# EAGLE design LPC_4TE_4.03bot (EAGLE 5.04)
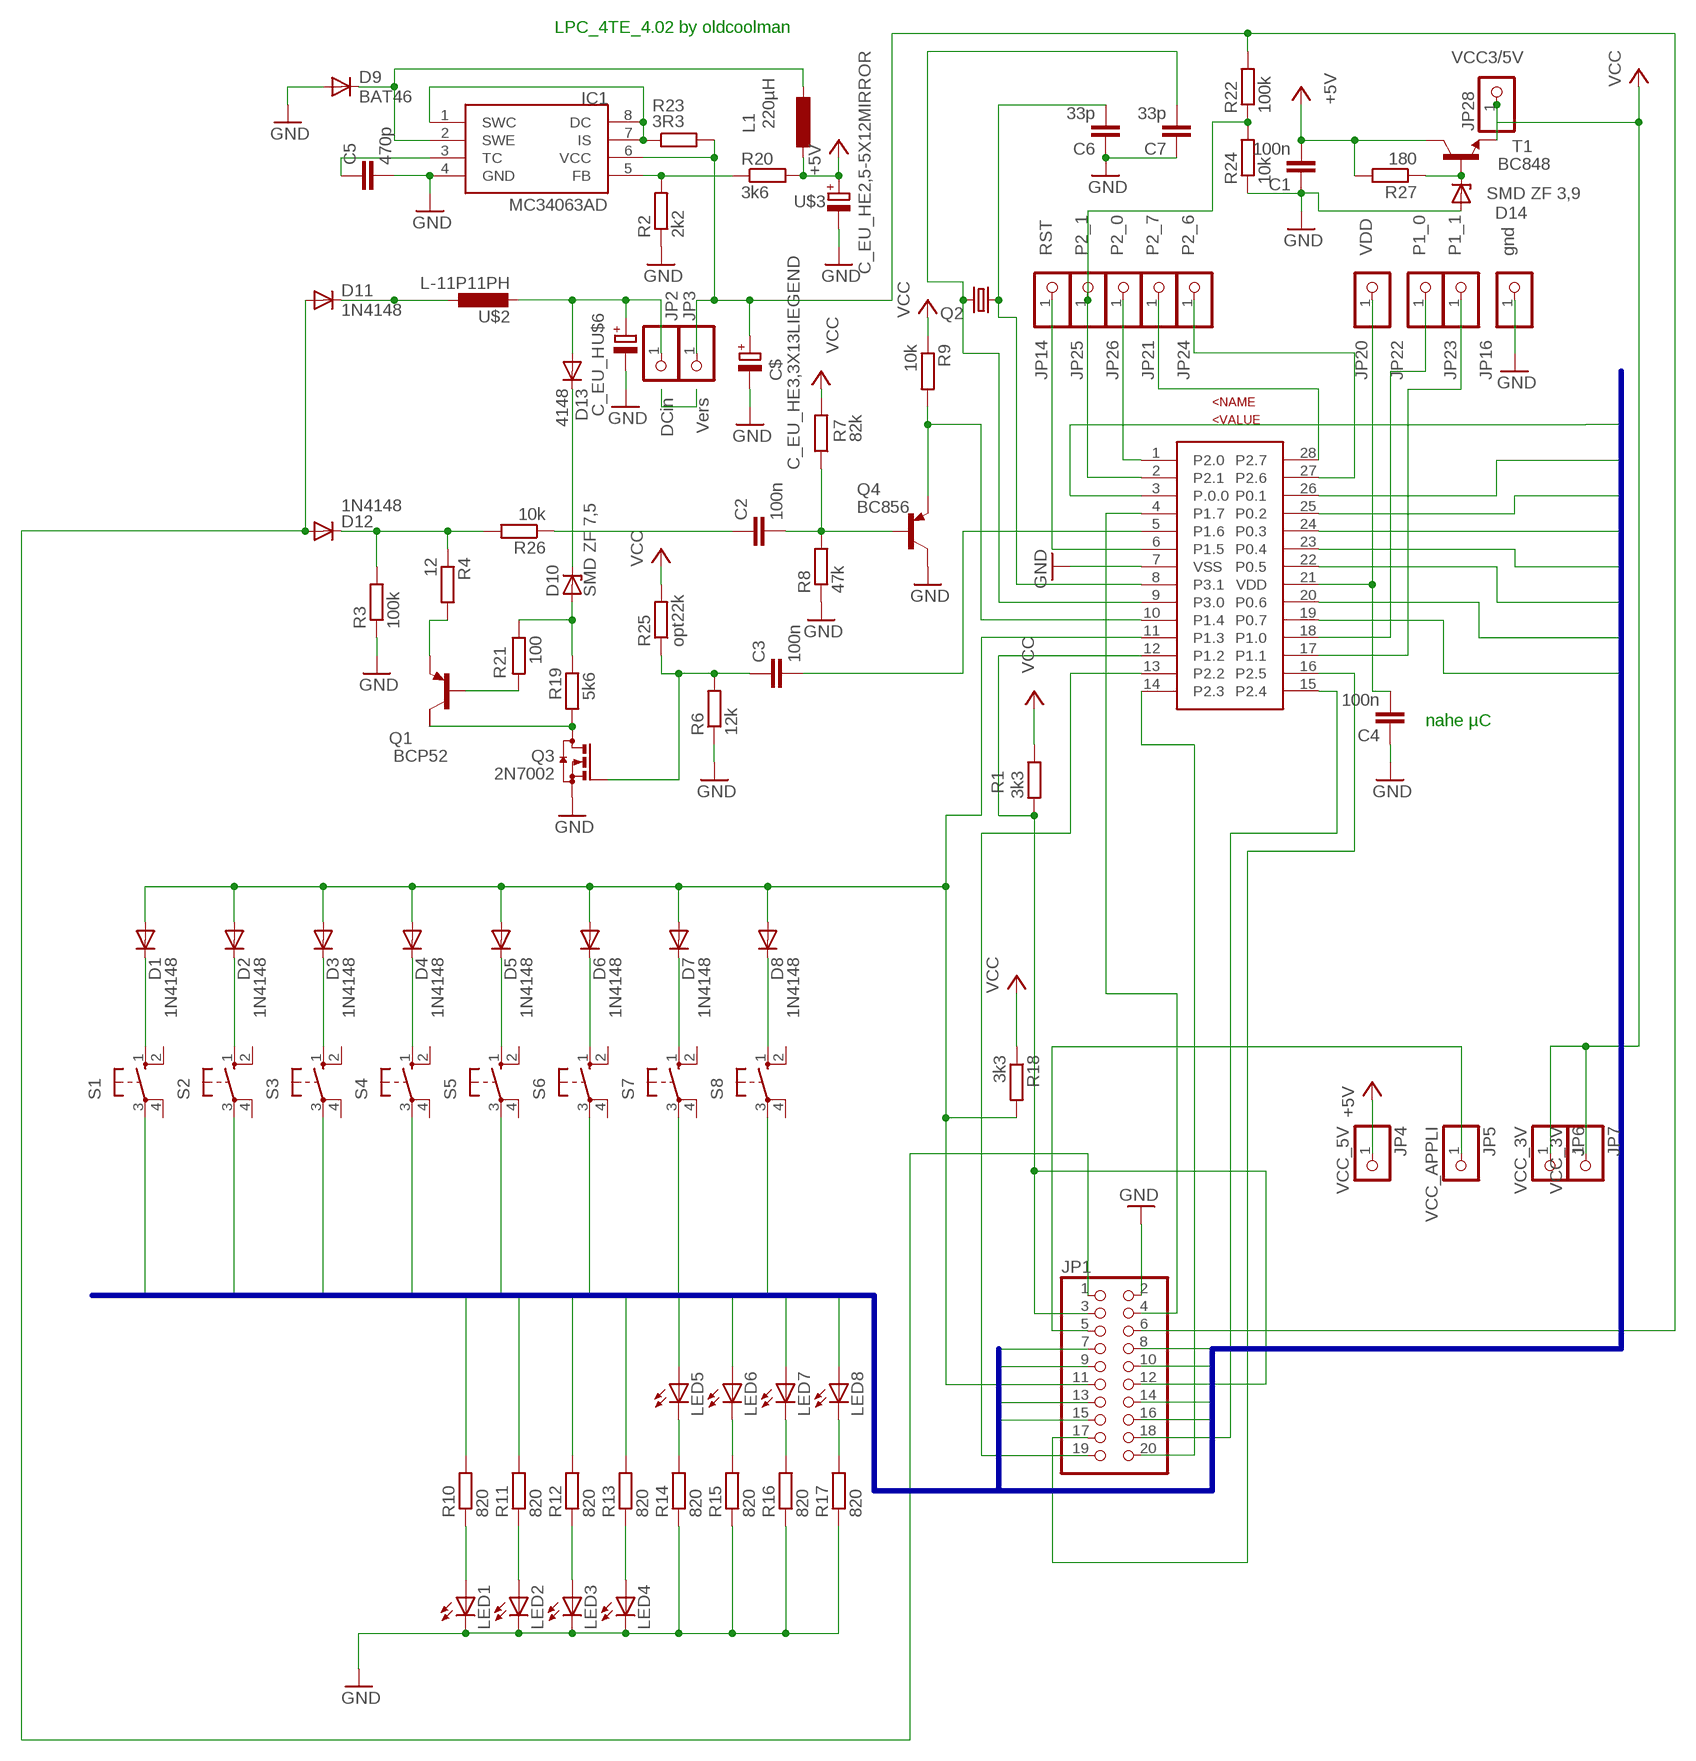
[diagram p0: schematic, sheet 1]

## Parts
C1  100n  C-EUC1206  [C1206]
C2  100n  C-EUC1206  [C1206]
C3  100n  C-EUC1206  [C1206]
C4  100n  C-EUC1206  [C1206]
C5  470p  C-EUC1206  [C1206]
C6  33p  C-EUC1206  [C1206]
C7  33p  C-EUC1206  [C1206]
C$  C_EU_HE3,3X13LIEGEND  [E3,3-7,5X13]
D1  1N4148  DIODE-MINIMELF  [MINIMELF]
D2  1N4148  DIODE-MINIMELF  [MINIMELF]
D3  1N4148  DIODE-MINIMELF  [MINIMELF]
D4  1N4148  DIODE-MINIMELF  [MINIMELF]
D5  1N4148  DIODE-MINIMELF  [MINIMELF]
D6  1N4148  DIODE-MINIMELF  [MINIMELF]
D7  1N4148  DIODE-MINIMELF  [MINIMELF]
D8  1N4148  DIODE-MINIMELF  [MINIMELF]
D9  BAT46  DIODE-MINIMELF  [MINIMELF]
D10  SMD ZF 7,5  ZPD  [MINIMELF]
D11  1N4148  DIODE-MINIMELF  [MINIMELF]
D12  1N4148  DIODE-MINIMELF  [MINIMELF]
D13  4148  DIODE-MINIMELF  [MINIMELF]
D14  SMD ZF 3,9  ZPD  [MINIMELF]
IC1  MC34063AD  [SOIC8]
JP1  PINHD-2X10  [2X10]
JP2  DCin  PINHD-1X1  [1X01]
JP3  Vers  PINHD-1X1  [1X01]
JP4  VCC_5V  PINHD-1X1  [1X01]
JP5  VCC_APPLI  PINHD-1X1  [1X01]
JP6  VCC_3V  PINHD-1X1  [1X01]
JP7  VCC_3V  PINHD-1X1  [1X01]
JP14  RST  PINHD-1X1  [1X01]
JP16  gnd  PINHD-1X1  [1X01]
JP20  VDD  PINHD-1X1  [1X01]
JP21  P2_7  PINHD-1X1  [1X01]
JP22  P1_0  PINHD-1X1  [1X01]
JP23  P1_1  PINHD-1X1  [1X01]
JP24  P2_6  PINHD-1X1  [1X01]
JP25  P2_1  PINHD-1X1  [1X01]
JP26  P2_0  PINHD-1X1  [1X01]
JP28  VCC3/5V  PINHD-1X1  [1X01]
L1  220µH  L-EU2200-11.43  [2200-11.43]
LED1  LED3MM  [LED3MM]
LED2  LED3MM  [LED3MM]
LED3  LED3MM  [LED3MM]
LED4  LED3MM  [LED3MM]
LED5  LED3MM  [LED3MM]
LED6  LED3MM  [LED3MM]
LED7  LED3MM  [LED3MM]
LED8  LED3MM  [LED3MM]
Q1  BCP52  FZT753SMD  [SOT223]
Q2  CRYSTALHC49U-V  [HC49U-V]
Q3  2N7002  BSS123  [SOT23]
Q4  BC856  BC856ALT1SMD  [SOT23-BEC]
R1  3k3  R-EU_M1206  [M1206]
R2  2k2  R-EU_R1206  [R1206]
R3  100k  R-EU_M1206  [M1206]
R4  12  R-EU_R1206  [R1206]
R6  12k  R-EU_R1206  [R1206]
R7  82k  R-EU_R1206  [R1206]
R8  47k  R-EU_M1206  [M1206]
R9  10k  R-EU_R1206  [R1206]
R10  820  R-EU_R1206  [R1206]
R11  820  R-EU_R1206  [R1206]
R12  820  R-EU_R1206  [R1206]
R13  820  R-EU_R1206  [R1206]
R14  820  R-EU_R1206  [R1206]
R15  820  R-EU_R1206  [R1206]
R16  820  R-EU_R1206  [R1206]
R17  820  R-EU_R1206  [R1206]
R18  3k3  R-EU_R1206  [R1206]
R19  5k6  R-EU_M1206  [M1206]
R20  3k6  R-EU_M1206  [M1206]
R21  100  R-EU_R1206  [R1206]
R22  100k  R-EU_R1206  [R1206]
R23  3R3  R-EU_M1206  [M1206]
R24  10k  R-EU_R1206  [R1206]
R25  opt22k  R-EU_R1206  [R1206]
R26  10k  R-EU_R1206  [R1206]
R27  180  R-EU_R1206  [R1206]
S1  10-XX  [B3F-10XX]
S2  10-XX  [B3F-10XX]
S3  10-XX  [B3F-10XX]
S4  10-XX  [B3F-10XX]
S5  10-XX  [B3F-10XX]
S6  10-XX  [B3F-10XX]
S7  10-XX  [B3F-10XX]
S8  10-XX  [B3F-10XX]
T1  BC848  [SOT23]
U$1  LPC936TSSOP28  [TSSOP28]
U$2  L-11P11PH  [11PH]
U$3  C_EU_HE2,5-5X12MIRROR  [E2,5-5X12MIRR]
U$6  C_EU_H  [E2,5-5X12]

## Nets
+5V: C1.2 JP4.1 L1.1 R20.2 R27.2 T1.3(C) U$3.+
GND: C1.1 C4.1 C5.2 C6.1 C7.1 C$.- D9.A D14.A IC1.4(GND) JP1.2 JP16.1 LED1.K(C) LED2.K(C) LED3.K(C) LED4.K(C) Q3.2(S) Q4.C R2.1 R3.1 R6.1 R8.1 R14.1 R15.1 R16.1 R17.1 R24.1 U$1.7(VSS) U$3.- U$6.-
N$1: D1.C S1.1(S)
N$2: D2.C S2.1(S)
N$3: D3.C S3.1(S)
N$4: D4.C S4.1(S)
N$5: D14.C R27.1 T1.1(B)
N$6: D5.C S5.1(S)
N$7: D6.C S6.1(S)
N$8: D7.C S7.1(S)
N$10: D8.C S8.1(S)
N$11: D13.A JP2.1 U$2.P$2 U$6.+
N$12: C$.+ IC1.6(VCC) JP1.6 JP3.1 R22.2 R23.2
N$13: JP1.5 JP5.1
N$14: LED5.K(C) R14.2
N$15: LED1.A R10.1
N$16: LED6.K(C) R15.2
N$17: LED7.K(C) R16.2
N$18: LED8.K(C) R17.2
N$19: Q4.E R9.2 U$1.10(P1.4)
N$20: LED2.A R11.1
N$21: LED3.A R12.1
N$22: LED4.A R13.1
N$23: C2.2 Q4.B R7.1 R8.2
N$24: C3.2 U$1.5(P1.6)
N$25: D12.C R3.2 R4.1 R26.2
N$26: IC1.5(FB) R2.2 R20.1
N$27: D9.C IC1.2(SWE) L1.2
N$28: C5.1 IC1.3(TC)
N$29: JP22.1 U$1.18(P1.0)
N$30: JP23.1 U$1.17(P1.1)
N$31: JP14.1 U$1.6(P1.5)
N$32: C4.2 JP20.1 U$1.21(VDD)
N$33: D1.A D2.A D3.A D4.A D5.A D6.A D7.A D8.A JP1.11 R18.2 U$1.11(P1.3)
N$34: C3.1 Q3.1(G) R6.2 R25.1
N$35: JP25.1 R22.1 R24.2 U$1.2(P2.1)
N$36: D11.C U$2.P$1
N$37: Q1.2(C) Q3.3(D) R19.1
N$38: D10.A R19.2 R21.1
N$39: Q1.3(E) R4.2
N$40: Q1.1(B) R21.2
N$41: D10.C D13.C
N$42: JP1.18 U$1.15(P2.4)
N$43: JP1.4 U$1.4(P1.7)
N$44: D11.A D12.A JP1.1
N$45: C6.2 Q2.1 U$1.8(P3.1)
N$46: C7.2 Q2.2 U$1.9(P3.0)
N$47: JP1.19 U$1.13(P2.2)
N$48: JP1.17 U$1.16(P2.5)
N$49: JP1.20 U$1.14(P2.3)
N$50: JP1.3 JP1.12 R1.2 U$1.12(P1.2)
N$51: C2.1 R26.1
N$56: JP21.1 U$1.28(P2.7)
N$57: JP24.1 U$1.27(P2.6)
N$58: JP26.1 U$1.1(P2.0)
N$61: IC1.1(SWC) IC1.7(IS) IC1.8(DC) R23.1
P0.0: JP1.7 R10.2 S1.3(P) U$1.3(P.0.0)
P0.1: JP1.8 R11.2 S2.3(P) U$1.26(P0.1)
P0.2: JP1.9 R12.2 S3.3(P) U$1.25(P0.2)
P0.3: JP1.10 R13.2 S4.3(P) U$1.24(P0.3)
P0.4: JP1.13 LED5.A S5.3(P) U$1.23(P0.4)
P0.5: JP1.14 LED6.A S6.3(P) U$1.22(P0.5)
P0.6: JP1.15 LED7.A S7.3(P) U$1.20(P0.6)
P0.7: JP1.16 LED8.A S8.3(P) U$1.19(P0.7)
VCC: JP6.1 JP7.1 JP28.1 R1.1 R7.2 R9.1 R18.1 R25.2 T1.2(E)
Unconnected: Q1.4(C/) S1.2(S1) S1.4(P1) S2.2(S1) S2.4(P1) S3.2(S1) S3.4(P1) S4.2(S1) S4.4(P1) S5.2(S1) S5.4(P1) S6.2(S1) S6.4(P1) S7.2(S1) S7.4(P1) S8.2(S1) S8.4(P1)

## Buses
P0.[0..7]

## Notes on the sheet
- LPC_4TE_4.02 by oldcoolman
- nahe µC

## Library data of the parts
C1-C7 = rcl:C-EU: CAPACITOR, European symbol
C$ U$3 U$6 = rcl:C_EU_H
D1-D9 D11-D13 = diode:DIODE-: DIODE
D10 D14 = diode:ZPD: Z DIODE 500 mW
IC1 = mc34063:MC34063
JP1 = pinhead:PINHD-2X10: PIN HEADER
JP2-JP7 JP14 JP16 JP20-JP26 JP28 = pinhead:PINHD-1X1: PIN HEADER
L1 = rcl:L-EU: INDUCTOR, European symbol
LED1-LED8 = led:LED: LED OSRAM: - CHIPLED LG R971, LG N971, LY N971, LG Q971, LY Q971, LO R971, LY R971 LH N974, LH R974 LS Q976, LO Q976, LY Q976 LO Q996 - Hyper CHIPLED LW Q18S LB Q993, LB Q99A, LB R99A - SideLED LS A670, LO A670, LY A670, LG A670, LP A670 LB A673, LV A673, LT A673, LW A673 LH A674 LY A675 LS A676, LA A676, LO A676, LY A676, LW A676 LS A679, LY A679, LG A679 - Hyper Micro SIDELED® LS Y876, LA Y876, LO Y876, LY Y876 LT Y87S - SmartLED LW L88C, LW L88S LB L89C, LB L89S, LG L890 LS L89K, LO L89K, LY L89K LS L896, LA L896, LO L896, LY L896 - TOPLED LS T670, LO T670, LY T670, LG T670, LP T670 LSG T670, LSP T670, LSY T670, LOP T670, LYG T670 LG T671, LOG T671, LSG T671 LB T673, LV T673, LT T673, LW T673 LH T674 LS T676, LA T676, LO T676, LY T676, LB T676, LH T676, LSB T676, LW T676 LB T67C, LV T67C, LT T67C, LS T67K, LO T67K, LY T67K, LW E67C LS E67B, LA E67B, LO E67B, LY E67B, LB E67C, LV E67C, LT E67C LW T67C LS T679, LY T679, LG T679 LS T770, LO T770, LY T770, LG T770, LP T770 LB T773, LV T773, LT T773, LW T773 LH T774 LS E675, LA E675, LY E675, LS T675 LS T776, LA T776, LO T776, LY T776, LB T776 LHGB T686 LT T68C, LB T68C - Hyper Mini TOPLED® LB M676 - Mini TOPLED Santana® LG M470 LS M47K, LO M47K, LY M47K Source: http://www.osram.convergy.de - LUMILED® LXK2-PW12-R00, LXK2-PW12-S00, LXK2-PW14-U00, LXK2-PW14-V00 LXK2-PM12-R00, LXK2-PM12-S00, LXK2-PM14-U00 LXK2-PE12-Q00, LXK2-PE12-R00, LXK2-PE12-S00, LXK2-PE14-T00, LXK2-PE14-U00 LXK2-PB12-K00, LXK2-PB12-L00, LXK2-PB12-M00, LXK2-PB14-N00, LXK2-PB14-P00, LXK2-PB14-Q00 LXK2-PR12-L00, LXK2-PR12-M00, LXK2-PR14-Q00, LXK2-PR14-R00 LXK2-PD12-Q00, LXK2-PD12-R00, LXK2-PD12-S00 LXK2-PH12-R00, LXK2-PH12-S00 LXK2-PL12-P00, LXK2-PL12-Q00, LXK2-PL12-R00 Source: www.luxeon.com
Q1 = transistor-pnp:FZT753SMD: PNP Transistor
Q2 = crystal:CRYSTAL: CRYSTAL
Q3 = transistor-small-signal:BSS123: N-CHANNEL MOS FET
Q4 = transistor-pnp:BC856*: PNP Transistror
R1-R4 R6-R27 = rcl:R-EU_: RESISTOR, European symbol
S1-S8 = switch-omron:10-XX: OMRON SWITCH
T1 = transistor:BC848: NPN TRANSISTOR
U$1 = freebuslpc:LPC936: C51 Based Microcontroller LPC936 ADC and 16kbyte Flash
U$2 = rcl:L-11P

## Board
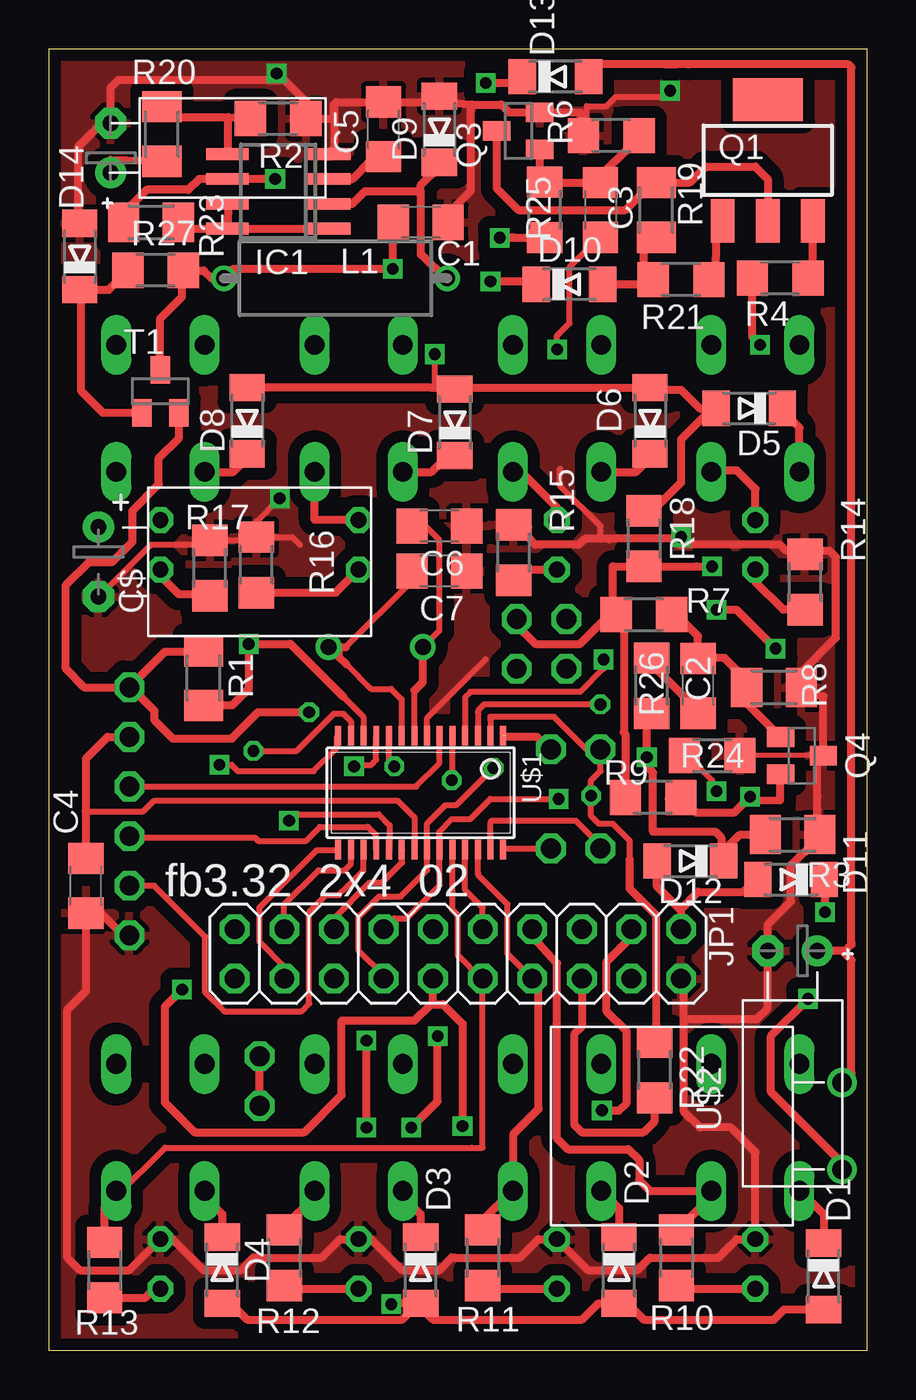
[diagram p1: board, top side]
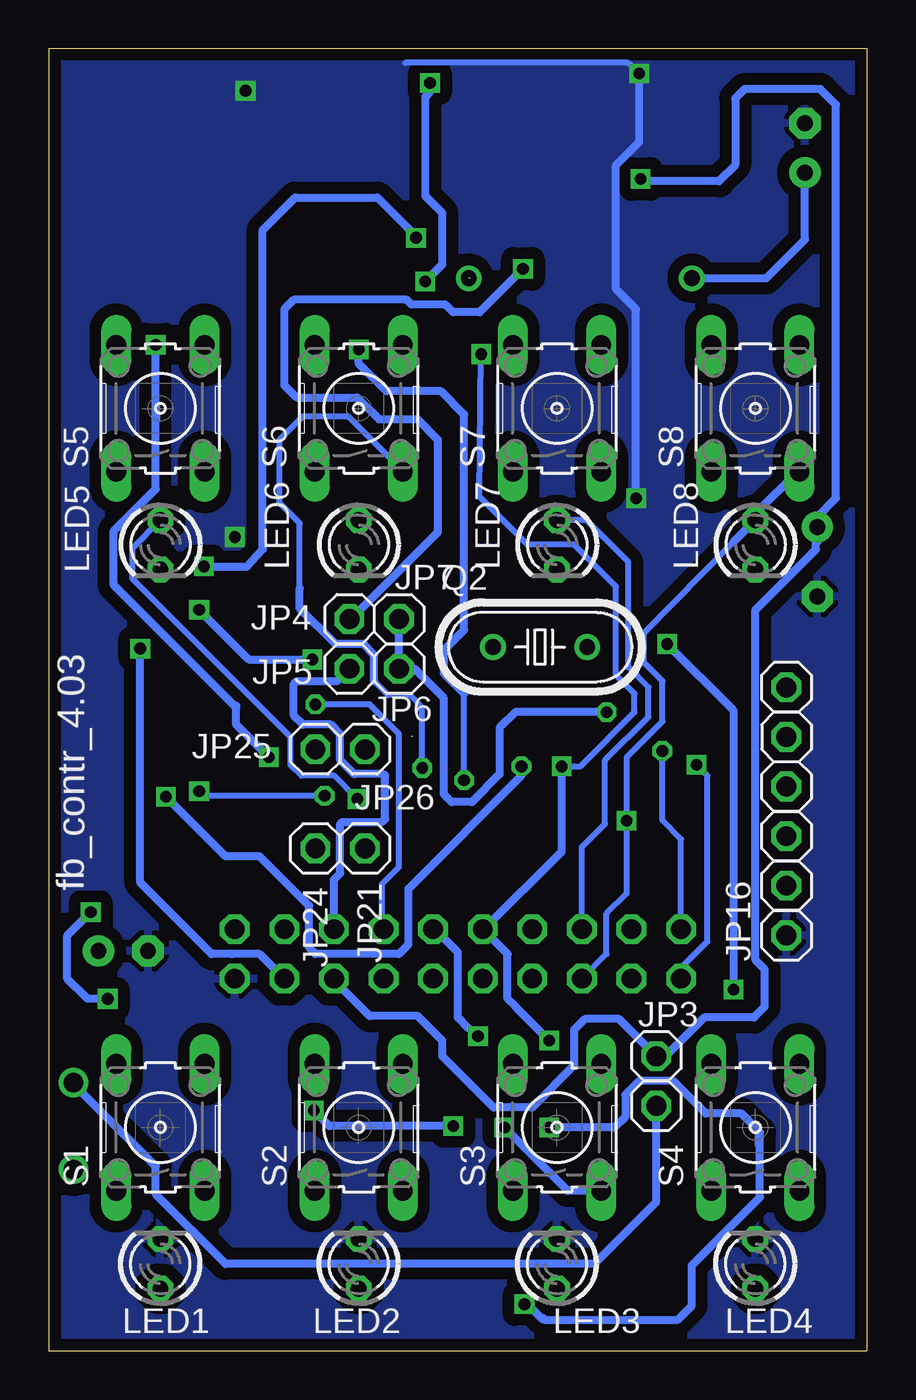
[diagram p2: board, bottom side, seen from below]

Size 41.91 x 66.67 mm. Coordinates in mm from the lower left corner, seen from the top.
Outline: 0,66.68 41.91,66.68 41.91,0 0,0 0,66.68
Copper layers (1*16): Top 0.035mm / dielectric 1.5mm / Bottom 0.035mm
Design rules "default *": minimum track width 10mil, minimum drill 24mil, track to track 12mil, track to pad 12mil, pad to pad 12mil, via to via 12mil, smd to smd 8mil, copper to edge 0.5mm, drill to drill 8mil, minimum pad ring 10mil, minimum via ring 8mil, stop-mask expansion 4mil, vias tented up to drill 0mil, thermal gap 10mil

### Footprints (pad centres in the part's own frame; a part is rotated, then mirrored left to right if it is on the bottom)
C1206 = smd 1.6 x 1.8: 1 -1.4,0; 2 1.4,0
E3,3-7,5X13 = drill 0.813 pad 1.6 round: + -1.778,0 | drill 0.813 pad 1.6 octagon: - 1.778,0
MINIMELF = smd 1.4 x 1.8: A 1.7,0; C -1.7,0
SOIC8 = smd 0.6 x 2.2: 1 -1.905,-2.6; 2 -0.635,-2.6; 3 0.635,-2.6; 4 1.905,-2.6; 5 1.905,2.6; 6 0.635,2.6; 7 -0.635,2.6; 8 -1.905,2.6
2X10 = drill 1.016 octagon: 1 -11.43,-1.27; 2 -11.43,1.27; 3 -8.89,-1.27; 4 -8.89,1.27; 5 -6.35,-1.27; 6 -6.35,1.27; 7 -3.81,-1.27; 8 -3.81,1.27; 9 -1.27,-1.27; 10 -1.27,1.27; 11 1.27,-1.27; 12 1.27,1.27; 13 3.81,-1.27; 14 3.81,1.27; 15 6.35,-1.27; 16 6.35,1.27; 17 8.89,-1.27; 18 8.89,1.27; 19 11.43,-1.27; 20 11.43,1.27
1X01 = drill 1.016 octagon: 1 0,0
2200-11.43 = drill 0.8 pad 1.27 round: 1 -5.715,0; 2 5.715,0
LED3MM = drill 0.813 octagon: A -1.27,0; K 1.27,0
SOT223 = smd 1.219 x 2.235: 1 -2.311,-3.099; 2 0,-3.099; 3 2.311,-3.099 | smd 3.6 x 2.2: 4 0,3.099
HC49U-V = drill 0.813 round: 1 -2.413,0; 2 2.413,0
SOT23 = smd 1 x 1.4: 1 -0.95,-1.1; 2 0.95,-1.1; 3 0,1.1
SOT23-BEC = smd 1 x 1.4: B -0.95,-1.1; C 0,1.1; E 0.95,-1.1
M1206 = smd 1.6 x 2: 1 -1.4,0; 2 1.4,0
R1206 = smd 1.6 x 1.803: 1 -1.422,0; 2 1.422,0
B3F-10XX = drill 1.016 long: 1 -3.251,2.261; 2 3.251,2.261; 3 -3.251,-2.261; 4 3.251,-2.261
TSSOP28 = smd 0.305 x 0.991: 1 -4.225,-2.918; 2 -3.575,-2.918; 3 -2.925,-2.918; 4 -2.275,-2.918; 5 -1.625,-2.918; 6 -0.975,-2.918; 7 -0.325,-2.918; 8 0.325,-2.918; 9 0.975,-2.918; 10 1.625,-2.918; 11 2.275,-2.918; 12 2.925,-2.918; 13 3.575,-2.918; 14 4.225,-2.918; 15 4.225,2.918; 16 3.575,2.918; 17 2.925,2.918; 18 2.275,2.918; 19 1.625,2.918; 20 0.975,2.918; 21 0.325,2.918; 22 -0.325,2.918; 23 -0.975,2.918; 24 -1.625,2.918; 25 -2.275,2.918; 26 -2.925,2.918; 27 -3.575,2.918; 28 -4.225,2.918
11PH = drill 1 round: P$1 -2.223,0; P$2 2.223,0
E2,5-5X12MIRR = drill 0.813 pad 1.6 round: + -1.27,0 | drill 0.813 pad 1.6 octagon: - 1.27,0
E2,5-5X12 = drill 0.813 pad 1.6 round: + -1.27,0 | drill 0.813 pad 1.6 octagon: - 1.27,0

### Placement (x,y rotation side)
C1  19.05,57.79 180 top
C2  33.26,34.05 90 top
C3  28.26,58.42 270 top
C4  1.91,23.81 90 top
C5  17.15,62.55 90 top
C6  20,42.23 180 top
C7  20,39.93 180 top
C$  2.54,40.4 270 top
D1  39.69,3.81 270 top
D2  29.21,4.13 270 top
D3  19.05,4.13 270 top
D4  8.89,4.13 270 top
D5  35.88,48.26 180 top
D6  30.8,47.62 90 top
D7  20.8,47.55 90 top
D8  10.16,47.62 90 top
D9  20,62.55 90 top
D10  26.67,54.61 0 top
D11  38.02,24.13 180 top
D12  32.86,25.08 180 top
D13  25.96,65.25 0 top
D14  1.59,56.04 90 top
IC1  11.75,59.37 90 top
JP1  20.95,20.32 180 top
JP2  10.8,12.54 0 bottom
JP3  10.8,15.08 0 bottom
JP4  26.51,37.47 0 bottom
JP5  26.51,34.92 0 bottom
JP6  23.97,34.93 0 bottom
JP7  23.97,37.47 0 bottom
JP14  4.13,28.89 270 bottom
JP16  4.13,21.27 90 bottom
JP20  4.13,31.43 0 bottom
JP21  25.72,25.72 270 bottom
JP22  4.13,26.35 90 bottom
JP23  4.13,23.81 270 bottom
JP24  28.26,25.72 270 bottom
JP25  28.26,30.8 270 bottom
JP26  25.72,30.8 270 bottom
JP28  4.13,33.97 270 bottom
L1  14.68,54.93 0 top
LED1  36.2,4.45 90 bottom
LED2  26.04,4.45 90 bottom
LED3  15.88,4.45 90 bottom
LED4  5.72,4.45 90 bottom
LED5  36.2,41.27 270 bottom
LED6  26.04,41.27 270 bottom
LED7  15.88,41.27 270 bottom
LED8  5.72,41.27 270 bottom
Q1  36.83,60.96 0 top
Q2  16.75,36.04 0 bottom
Q3  24.05,62.47 90 top
Q4  38.58,30.48 270 top
R1  7.94,34.45 270 top
R2  11.75,63.1 180 top
R3  38.1,26.43 180 top
R4  37.47,54.93 0 top
R6  28.81,62.23 0 top
R7  30.48,37.7 180 top
R8  37.15,33.97 180 top
R9  30.96,28.34 0 top
R10  32.15,4.76 90 top
R11  22.23,4.76 90 top
R12  12.06,4.76 90 top
R13  2.86,4.13 90 top
R14  38.73,39.37 270 top
R15  23.81,40.88 270 top
R16  10.64,40.24 270 top
R17  8.26,40.08 270 top
R18  30.48,41.59 90 top
R19  31.12,58.42 270 top
R20  5.79,62.31 270 top
R21  32.38,54.85 0 top
R22  31.04,14.37 270 top
R23  5.24,57.79 180 top
R24  33.97,30.48 180 top
R25  25.4,58.42 270 top
R26  30.88,34.05 270 top
R27  5.48,55.32 0 top
S1  36.2,11.43 90 bottom
S2  26.04,11.43 90 bottom
S3  15.88,11.43 90 bottom
S4  5.72,11.43 90 bottom
S5  36.2,48.26 90 bottom
S6  26.04,48.26 90 bottom
S7  15.88,48.26 90 bottom
S8  5.72,48.26 90 bottom
T1  5.72,49.13 0 top
U$1  19.05,28.58 180 top
U$2  40.64,11.51 90 top
U$3  3.17,61.59 90 top
U$6  38.1,20.48 180 top

### Tracks (layer width: path | path; a pad name or v marks a point on that pad's centre or on a via)
+5V  (via drill 0.6)
  Top 0.406: R20.2 3.15,60.99 U$3.+ | C1.2 17.62,57.76 v17.62,55.4 9.45,55.4 L1.1 8.33,54.93 7.94,55.32 R27.2 6.83,55.25 6.83,53.97 5.71,52.86 T1.3
  Bottom 0.406: JP4.1 26.43,37.47 21.99,41.91 21.99,46.67 23.02,47.7 25,47.7 26.11,48.82 29.21,48.82 29.84,49.45 29.84,53.34 29.37,53.82 23.57,53.82 23.34,53.58 21.59,53.58 21.19,53.18 19.84,53.18 v17.62,55.4 | L1.1 5.16,54.93 3.17,56.91 U$3.+
GND  (via drill 0.6)
  Top 0.254: Q4.C R24.1
  Top 0.305: 2.54,37.94 C$.- 2.59,38.62 5.24,41.27 8.02,41.27 R17.1 10.48,41.51 R16.1 | U$1.7 19.37,32.39 21.51,34.53 | Q4.C 39.69,30.48 | 21.51,34.53 | 21.51,34.53 22.38,35.4 | C6.1 21.19,42.52 21.19,42.15 | R15.1 23.36,42.75 | 12.86,41.27 12.47,41.67 R16.1 | v11.83,43.66 10.64,42.47 R16.1 | v31.83,64.53 31.51,64.21 29.05,64.21 28.57,63.74 27.54,63.74 27.54,62.47 | 26.19,45.16 26.19,44.29 28.26,42.23 28.26,41.59
  Top 0.406: 14.6,63.82 14.6,63.1 R2.1 13.02,63.18 13.33,63.5 13.33,63.82 12.06,65.09 3.57,65.09 3.17,64.69 U$3.- 2.7,62.87 1.51,61.67 1.51,57.82 D14.A | 14.6,63.82 14.73,63.95 C5.2 19.5,63.95 19.8,64.25 D9.A | C1.1 20.45,58.23 21.59,59.37 21.59,63.82 21.67,63.82 | IC1.4 14.29,61.28 14.6,61.59 14.6,63.82 | 32.54,16.99 32.54,12.22 33.34,11.43 34.92,11.43 36.19,10.16 LED1.K 35.24,5.72 34.29,4.76 30.8,4.76 30.16,4.13 27.62,4.13 LED2.K 25.08,5.72 24.13,4.76 20.64,4.76 20,4.13 18.1,4.13 16.51,5.72 LED3.K 14.92,5.72 13.97,4.76 10.48,4.76 9.84,4.13 7.94,4.13 6.35,5.72 LED4.K 4.13,4.13 1.59,4.13 0.95,4.76 0.95,17.46 1.9,18.42 C4.1 2.67,22.41 3.81,21.27 JP16.1 | 32.54,16.99 32.54,18.81 32.38,18.97 JP1.2 | 39.37,26.19 39.42,26.38 R3.1 39.45,26.27 39.37,26.19 | 38.73,40.96 R14.1 | 38.73,40.96 40,40.96 40.32,40.64 40.32,36.51 38.55,34.74 R8.1 38.55,33.79 38.42,33.65 39.68,33.51 Q4.C 39.37,30.48 39.37,28.34 39.37,27.7 39.37,26.19 | 38.73,40.96 37.78,40.96 37.46,41.27 32.31,41.27 31.99,41.59 28.73,41.59 | 39.37,26.19 | 28.73,41.59 28.26,41.59 27.62,41.59 27.46,41.59 27.15,41.27 27.07,41.27 24.92,41.27 23.97,42.31 R15.1 | 28.73,41.59 28.7,41.56 | 39.37,26.19 38.02,24.84 38.02,23.02 36.83,21.83 U$6.- 36.83,17.54 36.27,16.99 32.54,16.99 | R6.1 27.23,62.23 27.23,63.42 24.91,63.42 | 24.91,63.42 Q3.2 | D9.A 20.04,64.21 | C$.- 2.82,38.34 | 24.91,63.42 23.57,63.42 23.18,63.82 21.67,63.82 | 21.67,63.82 20.27,63.98 D9.A
  Bottom 0.305: 23.65,65.96 12.22,65.96 v11.67,65.41
  Bottom 0.406: v11.67,65.41 11.67,61.91 12.86,60.72 12.86,54.37 11.83,53.34 v11.83,43.66
  other vias: 32.38,41.67
  pour Top (isolate 0.61): 41.91,66.83 41.91,0.16 -0.16,0.16 -0.16,66.83
  pour Bottom (isolate 0.61): 41.91,66.52 41.91,0.16 -0.16,0.16 -0.16,66.67 40.96,66.67
N$1
  Top 0.406: 38.46,8.22 38.42,8.25 | S1.1 38.46,8.22 | D1.C 39.69,6.98 38.46,8.22
N$2
  Top 0.406: 28.3,8.22 28.26,8.25 | S2.1 28.3,8.22 | D2.C 29.21,7.3 28.3,8.22
N$3
  Top 0.406: S3.1 18.14,7.98 18.1,7.94 19.05,6.98 D3.C
N$4
  Top 0.406: S4.1 7.98,7.98 7.94,7.94 8.89,6.98 D4.C
N$5
  Top 0.406: R27.1 3.07,54.34 D14.C 1.67,54.26 1.67,49.13 2.77,48.03 T1.1
N$6
  Top 0.406: D5.C 37.46,48.26 38.46,47.27 S5.1
N$7
  Top 0.406: D6.C 30.8,45.72 30.09,45.01 S6.1
N$8
  Top 0.406: D7.C 20.32,45.72 19.61,45.01 S7.1
N$10
  Top 0.406: D8.C 10.16,45.72 9.45,45.01 S8.1
N$11
  Top 0.406: 32.78,65.88 40.96,65.88 41.12,65.72 41.12,20.8 | 32.78,65.88 31.59,65.88 | 41.12,20.8 41.12,20.88 | 31.59,65.88 | 41.12,20.8 40.8,20.48 40.72,20.48 | 40.72,20.48 U$6.+ | U$2.P$2 41.12,14.21 41.12,20 40.72,20.4 40.72,20.48 | 31.59,65.88 32.15,65.88 | 32.78,65.88 | 31.59,65.88 28.29,65.88 D13.A | JP2.1 10.79,15.08
  Bottom 0.406: JP2.1 10.79,7.62 13.97,4.44 32.86,4.44 36.43,8.02 36.43,9.45 40.56,13.57 U$2.P$2
N$12  (via drill 0.6)
  Top 0.406: C$.+ 2.54,41.67 | 3.36,57.81 3.41,57.86 | 3.36,57.81 R23.2 3.33,57.79 | 3.33,57.79 3.36,57.81 | 3.33,57.79 5,59.45 7.14,59.45 7.7,60.01 IC1.6 v11.59,60.01 | R22.2 31.04,11.75 30.48,11.19 27.3,11.19 26.91,11.59 26.91,16.19 27.3,16.59 JP1.6
  Bottom 0.406: JP3.1 10.32,15.08 8.33,17.07 5.79,17.07 5.24,17.62 5.24,19.53 5.71,20 5.71,37.94 2.62,41.04 2.62,41.35 2.54,41.43 2.54,41.67 | 2.54,41.67 C$.+ | JP1.6 27.3,18.97 25.48,17.15 23.02,17.15 21.75,15.87 21.75,15.08 19.13,12.46 17.14,12.46 15,14.6 15,16.43 14.45,16.99 12.7,16.99 JP3.1 | JP3.1 | 2.54,41.67 2.54,42.7 1.59,43.66 1.59,63.82 2.38,64.61 6.27,64.61 6.75,64.13 6.75,60.72 7.58,59.89 11.47,59.89 v11.59,60.01
N$13
  Bottom 0.406: JP1.5 27.3,24.13 26.99,24.45 26.99,26.99 26.91,27.07 24.84,27.07 24.69,27.23 24.69,29.45 24.76,29.53 26.27,29.53 26.99,30.24 26.99,31.59 27.46,32.07 28.89,32.07 29.37,32.54 29.37,34.13 29.21,34.29 27.15,34.29 JP5.1
N$14
  Top 0.406: R14.2 37.62,37.95 36.19,39.37 LED5.K 36.19,40.32
N$15
  Top 0.406: R10.1 32.54,3.34 32.54,3.18 LED1.A
N$16
  Top 0.406: R15.2 24.04,39.46 24.05,39.45 24.61,40.01 LED6.K
N$17
  Top 0.406: LED7.K 14.69,38.82 R16.2
N$18
  Top 0.406: R17.2 8.18,38.73 6.67,38.73 5.71,39.69 LED8.K
N$19  (via drill 0.6)
  Top 0.305: v17.7,29.92 17.42,30.2 U$1.10
  Top 0.406: 31.75,28.26 R9.2 33.18,27.54 35.08,27.54 v35.92,28.38 35.88,28.22 | 35.88,28.22 35.88,28.18 | Q4.E 37.46,28.18 35.88,28.22
  Bottom 0.406: v35.92,28.38 32.86,25.32 31.11,25.32 28.57,22.78 28.57,20.64 28.26,20.32 23.97,20.32 23.49,20.8 23.49,23.65 17.7,29.45 v17.7,29.92
N$20
  Top 0.406: R11.1 22.22,3.18 LED2.A
N$21
  Top 0.406: R12.1 12.22,3.34 12.38,3.18 LED3.A
N$22
  Top 0.406: LED4.A 5.4,3.18 4.93,2.71 R13.1
N$23
  Top 0.406: 36.51,32.38 Q4.B 36.2,32.7 35.75,33.15 R8.2 35.75,34.34 34.61,35.48 33.42,35.48 33.39,35.45 C2.2 33.26,35.48 | R7.1 32.15,37.7 33.26,36.59 33.26,35.48 | 33.26,35.48
N$24  (via drill 0.6)
  Top 0.305: U$1.5 20.67,29.25 v20.64,29.21 | v26.03,51.28 26.03,51.99 26.67,52.63 26.67,55.48 28.21,57.02 C3.2
  Bottom 0.305: v20.64,29.21 20.64,33.65
  Bottom 0.406: 20.64,33.65 21.67,34.69 21.67,35.88 20.64,36.91 20.64,47.94 21.83,49.13 24.61,49.13 26.03,50.56 v26.03,51.28
N$25  (via drill 0.6)
  Top 0.406: R3.2 35.4,26.43 34.53,25.56 D12.C 34.53,25 34.45,25.08 34.45,26.27 34.13,26.59 30.96,26.59 30.96,29.61 30.64,29.92 v30.64,30.4 30.64,32.63 R26.2 | R4.1 36.04,51.9 v36.43,51.51
  Bottom 0.406: 32.31,32.94 32.31,32.07 v30.64,30.4 | 32.31,32.94 32.31,33.02 | v36.43,51.51 36.43,44.13 38.58,41.99 38.58,39.21 32.31,32.94
N$26
  Top 0.406: R20.1 5.71,63.18 9.21,63.18 | 9.21,63.18 R2.2 | IC1.5 9.15,63.12 9.21,63.18
N$27  (1 unrouted)
  Top 0.406: D9.C 20,60.64 19.05,59.69 19.05,59.37 | 19.05,59.37 19.05,56.12 19.13,56.12 20.32,54.93 | IC1.2 15.56,58.74 16.19,59.37 19.05,59.37
N$28
  Top 0.406: IC1.3 15.56,60.01 16.51,60.96 17.14,60.96 C5.1
N$29
  Top 0.305: JP22.1 4.21,26.27 10.56,26.27 10.72,26.11 13.18,26.11 13.89,26.83 16.35,26.83 16.75,26.43 16.75,25.72 16.77,25.69 U$1.18
N$30
  Top 0.305: U$1.17 16.11,25.64 16.11,24.61 15.32,23.81 14.84,23.34 14.21,23.34 13.33,22.46 13.33,17.78 12.94,17.38 8.97,17.38 8.02,18.34 8.02,21.19 5.4,23.81 JP23.1
N$31
  Top 0.305: JP14.1 18.81,28.89 20,30.08 20,31.35 20,31.43 U$1.6
N$32
  Top 0.305: U$1.21 18.72,27.31 17.86,28.18 5.4,28.18 4.84,27.62 1.9,27.62 1.83,27.62
  Top 0.406: C4.2 1.9,27.62 1.9,30.32 3.02,31.43 JP20.1
N$33  (via drill 0.6)
  Top 0.305: U$1.11 16.77,30.27 16.51,30 15.72,30 v15.64,29.92 | 19.53,49.33 19.76,49.29 v19.76,51.04
  Top 0.406: D1.A 37.67,2.11 37.15,1.59 30.48,1.59 29.84,2.22 29.53,2.22 29.41,2.11 D2.A 28.14,2.43 27.3,1.59 19.68,1.59 19.05,2.22 D3.A | D3.A 18.94,2.43 18.1,1.59 10.16,1.59 9.21,2.54 9.09,2.43 D4.A | R18.2 30.95,43.01 32.38,44.45 32.38,46.67 33.97,48.26 D5.A 33.34,48.26 32.38,49.21 31.11,49.21 31,49.33 D6.A 20.52,49.33 20.32,49.53 D7.A 20.32,49.21 20.21,49.33 19.53,49.33 D8.A | D3.A 17.59,2.43 v17.54,2.38 | v16.27,11.43 v16.27,15.87
  Bottom 0.305: JP1.11 19.68,21.51 | v15.64,29.92 | v15.64,29.92 15,29.92 14.68,29.92 11.91,32.7 11.91,33.66 12.86,34.61 12.86,39.13 14.05,40.32 | 18.41,42.31 19.84,43.74 v19.76,51.04 | 18.41,42.31 | 18.41,42.31 17.38,41.27 15,41.27 14.05,40.32 | 14.05,40.32
  Bottom 0.406: v17.54,2.38 17.38,2.38 16.59,1.59 16.59,1.67 16.51,1.59 9.68,1.59 8.97,2.3 8.97,4.37 5.48,7.86 5.48,11.19 6.43,12.14 8.25,12.14 9.92,13.81 11.67,13.81 12.38,13.1 12.38,11.99 12.94,11.43 v16.27,11.43 | 18.41,18.02 18.41,20.32 JP1.11 19.61,21.59 15.64,25.56 v15.64,29.92 | 18.41,18.02 | 18.41,18.02 18.02,17.62 17.94,17.54 v16.27,15.87
N$34
  Top 0.406: Q3.1 25.15,60.5 25.64,60.01 R25.1 25.48,59.93 25.59,59.82 C3.1 28.26,60.17 29.84,61.75 R6.2 29.84,62.15 29.92,62.15
N$35  (via drill 0.6)
  Top 0.305: U$1.2 22.62,32.3 22.62,32.31 22.62,32.46 25.88,32.46 27.54,30.8 JP25.1 | JP25.1 28.34,30.8 | 29.77,25.16 29.77,26.11 28.89,26.99 28.18,26.99 27.78,27.38 27.78,28.34 v27.78,28.42 27.78,29.21 28.26,29.69 JP25.1 | R24.2 32.7,30.48 33.97,29.21 33.97,28.73 v34.21,28.65
  Top 0.406: 29.77,25.16 29.77,23.65 31.11,22.3 31.11,15.95 31.04,15.87 R22.1
  Bottom 0.305: v34.21,28.65 33.81,28.42 v27.78,28.42
N$36  (via drill 0.6)
  Top 0.406: 39.77,23.57 39.77,23.78 D11.C 39.77,24.13 v39.77,22.46 | U$2.P$1 40.64,9.6 36.99,13.26 36.99,16.11 v38.89,18.02
  Bottom 0.406: v38.89,18.02 39.93,18.02 40.96,19.05 40.96,21.27 v39.77,22.46
N$37
  Top 0.406: Q3.3 22.95,59.52 24.05,58.42 29.53,58.42 30.93,59.82 R19.1 32.83,59.82 33.65,60.64 36.19,60.64 36.83,60.01 Q1.2 36.83,58.1
N$38
  Top 0.406: 30.48,54.61 R21.1 | D10.A 30.48,54.61 | R19.2 30.98,57.02 30.48,56.51 30.48,54.61
N$39
  Top 0.406: R4.2 38.98,55.08 39.13,54.93 39.14,57.24 Q1.3
N$40
  Top 0.406: R21.2 34.18,54.8 34.2,57.24 Q1.1
N$41  (via drill 0.6)
  Top 0.406: D13.C 24.05,64.93 v22.38,64.93 | v22.62,54.77 24.81,54.77 D10.C
  Bottom 0.406: v22.38,64.93 22.38,64.45 22.62,64.21 22.62,59.13 21.75,58.26 21.75,55.64 v22.62,54.77
N$42
  Top 0.305: U$1.15 14.81,25.64 13.73,25.64 10.79,22.7 10.79,20.96 12.06,19.69 JP1.18
N$43  (via drill 0.6)
  Top 0.305: U$1.4 21.32,33.47 21.59,33.73 27.23,33.73 28.42,34.93 v28.42,35.4
  Top 0.406: v34.21,37.94 35.24,37.94 v37.23,35.96
  Bottom 0.406: v28.42,35.4 31.67,35.4 v34.21,37.94 | JP1.4 29.77,19.05 30.16,19.37 31.11,20.32 32.54,20.32 33.58,20.32 37.23,23.97 v37.23,35.96
N$44
  Top 0.406: D12.A 31.16,23.77 32.35,22.58 | 32.35,22.58 32.38,22.54 JP1.1 | D11.A 35.96,23.81 35.56,23.49 33.26,23.49 32.35,22.58
N$45
  Top 0.305: U$1.8 18.72,31.5 18.73,31.51 18.73,33.81 | Q2.1 20,36.88 20,41.51 19.29,42.23 C6.2
  Top 0.406: 18.73,33.81 19.16,34.24 Q2.1
N$46
  Top 0.305: U$1.9 18.07,33.36 17.54,33.89 16.51,33.89 15.24,35.16 | 15.21,36.04 18.6,39.43 C7.2
  Top 0.406: Q2.2 14.84,36.04 | 14.84,36.04 15.21,36.04 | 15.24,35.16 14.84,35.56 14.84,36.04
N$47  (via drill 0.6)
  Top 0.305: U$1.13 15.48,32.23 15.08,32.62 14.6,32.62 12.7,30.72 v10.48,30.72 10.87,30.72
  Bottom 0.305: v10.48,30.72 10.48,27.15 9.52,26.19 JP1.19
N$48
  Top 0.305: U$1.16 15.48,24.92 15.16,24.61 13.81,24.61 12.06,22.86 JP1.17
N$49  (via drill 0.6)
  Top 0.305: U$1.14 14.76,31.43 14.76,30.88 13.57,29.69 9.68,29.69 9.37,30 v8.73,30
  Bottom 0.305: v8.73,30 8.18,29.45 8.18,20.96 9.52,19.61 JP1.20 9.52,18.89
N$50  (via drill 0.6)
  Top 0.305: U$1.12 16.12,31.58 16.11,31.59 16.11,32.46 15.08,33.5
  Top 0.406: JP1.12 19.68,17.86 19.57,17.74 | 19.57,17.74 18.73,16.91 15,16.91 15,13.1 13.1,11.19 7.46,11.19 5.95,12.7 5.95,17.62 v6.83,18.49 | 19.57,17.74 20.2,17.74 21.19,16.75 v21.19,11.51 | 15.08,33.5 14.92,33.65 12.38,36.19 v10.24,36.19 10.24,33.89 9.4,33.05 R1.2 | JP1.3 29.84,21.19 28.57,19.92 28.57,17.38 29.61,16.35 29.61,12.7 29.21,12.3 v28.34,12.3 28.26,12.3
  Bottom 0.406: v6.83,18.49 6.83,32.78 v10.24,36.19 | v21.19,11.51 26.11,11.51 27.54,11.51 v28.34,12.3
N$51
  Top 0.406: 30.88,35.16 | 30.88,35.16 R26.1 | C2.1 33.26,32.78 30.88,35.16
N$56
  Top 0.305: U$1.28 23.34,25.72 JP21.1
N$57
  Top 0.305: U$1.27 22.62,27.07 22.7,27.15 26.99,27.15 28.26,25.88 JP24.1
N$58  (1 unrouted)
  Top 0.406: JP26.1 25.64,30.8 25,31.43 23.42,31.43 23.35,31.49
N$61
  Top 0.406: IC1.8 IC1.1 | IC1.7 9.21,58.58 9.19,57.72 IC1.8 | 6.19,57.55 R23.1 6.43,57.79 6.75,57.47 IC1.8
P0.0  (via drill 0.6)
  Top 0.305: U$1.3 21.97,32.69 21.99,32.7 21.99,32.78 22.3,33.1 v28.26,33.1
  Top 0.406: R10.2 32.38,6.35 33.97,7.94 33.93,7.98 S1.3 30.79,8.18 30.24,8.73 30.24,9.76 29.69,10.32 26.59,10.32 26.03,10.87 26.03,19.84 25.08,20.88 24.76,21.19 JP1.7
  Bottom 0.305: v28.26,33.1 25.48,33.1 23.97,31.59 23.97,24.77 24.84,23.89 24.84,21.75 24.76,21.67 JP1.7
P0.1
  Top 0.305: U$1.26 21.97,24.46 21.99,24.45 21.99,24.37 23.49,22.86 23.49,20.32 JP1.8
  Top 0.406: 23.77,8.22 23.81,8.25 23.81,11.11 25.08,12.38 25.08,18.73 JP1.8 | 23.77,8.22 S2.3 | R11.2 22.22,6.67 23.77,8.22
P0.2  (via drill 0.6)
  Top 0.305: U$1.25 21.32,23.6 22.22,22.7 JP1.9
  Top 0.406: S3.3 13.61,7.98 13.65,7.94 12.06,6.35 R12.2 | v18.57,11.43 19.68,12.54 19.92,12.78 v19.92,16.11
  Bottom 0.406: S3.3 15.32,8.18 18.49,11.35 18.49,11.43 v18.57,11.43 | v19.92,16.11 20.4,16.51 20.95,17.07 20.95,20.4 22.15,21.59 JP1.9
P0.3
  Top 0.305: U$1.24 20.67,22.58 20.95,22.3 20.95,20.24 22.15,19.05 JP1.10 22.22,10.4 21.67,10.4 5.95,10.4 3.45,7.9 S4.3
  Top 0.406: S4.3 3.45,7.98 3.49,7.94 2.86,7.3 R13.2
P0.4  (via drill 0.6)
  Top 0.305: JP1.13 17.7,22.15 18.34,22.15 20.02,23.83 U$1.23 20.02,26.14 20,26.11 20,26.59 20.64,27.23 21.59,27.23 22.62,28.26 v26.11,28.26
  Top 0.406: LED5.A 36.19,44.13 35.24,45.08 33.97,45.08 33.93,45.05 S5.3
  Bottom 0.305: v26.11,28.26 27.3,29.45 28.97,29.45 29.53,30 29.53,31.43 37.62,39.53 37.62,41.12 LED5.A
P0.5  (via drill 0.6)
  Top 0.305: JP1.14 17.14,19.21 15.87,20.48 15.87,22.22 16.91,23.26 18.02,23.26 19.37,24.61 U$1.22 19.37,26.99 20.32,27.94 20.88,27.94 v22.78,29.85
  Top 0.406: S6.3 24.21,45.01 26.03,43.18 LED6.A
  Bottom 0.305: v22.78,29.85 22.78,30.48 22.78,32.94 23.42,33.58 24.53,33.58 25.24,34.29 | S6.3 23.77,45.05 26.59,47.86 28.89,47.86 30.08,46.67 30.08,43.42 29.05,42.39 29.05,39.05
  Bottom 0.406: 25.24,34.29 25.24,35.64 25.8,36.19 27.23,36.19 29.05,38.02 29.05,39.05
P0.6
  Top 0.305: JP1.15 14.6,22.15 16.43,23.97 17.07,23.97 17.42,24.33 18.1,25 18.1,25.64 U$1.20
  Top 0.406: S7.3 13.61,42.55 LED7.A
  Bottom 0.305: 13.33,41.51 14.37,42.55 LED7.A | JP1.15 14.6,25.8 13.41,26.99 13.41,30.24 11.19,32.46 11.19,33.97 12.22,35 12.22,40.4 13.33,41.51 | 13.33,41.51
P0.7  (via drill 0.6)
  Top 0.305: v12.3,27.15 12.78,27.46 16.91,27.46 17.46,26.91 17.46,25.64 17.44,25.64 U$1.19
  Bottom 0.305: JP1.16 13.33,20.32 13.33,22.38 12.3,23.42 v12.3,27.15 12.3,30.4 10.48,32.23 10.48,34.29 11.43,35.24 11.43,35.64 11.43,36.75 6.83,41.43
  Bottom 0.406: S8.3 3.45,45.05 3.49,45.08 5.71,42.86 LED8.A 6.83,41.43 | JP1.16 14.6,18.97
VCC  (via drill 0.6)
  Top 0.406: v23.1,57 23.9,57 | 23.9,57 R25.2 | R18.1 33.17,40.17 v33.97,40.16 | R18.1 30.39,40.17 | R9.1 29.53,29.69 29.53,29.92 29.53,31.59 29.45,31.67 29.45,37.31 R7.2 | 23.9,57 23.17,57 23.1,57.07 | R1.1 7.94,35.8 5.95,35.8 JP28.1 | R7.2 | R7.2 28.89,37.87 | JP28.1 4.21,33.97 5.4,32.78 5.4,32.31 6.35,31.35 9.37,31.35 10.72,32.7 v13.33,32.7 13.41,32.86 | 28.89,37.87 28.89,40.16 28.9,40.17 R18.1 | 28.89,37.87 27.22,36.19 24.92,36.19 23.97,37.15 JP7.1 | T1.2 6.66,46.75 5.64,45.72 5.64,44.37 4.29,43.02 4.29,41.43 3.25,40.4 2.06,40.4 0.87,39.21 0.87,34.93 1.83,33.97 JP28.1
  Bottom 0.406: v23.1,57 23.1,57.07 25.08,59.05 29.29,59.05 30.96,57.39 30.96,41.04 31.75,40.16 v33.97,40.16 33.97,40.08 | v13.33,32.7 18.02,32.7 18.81,31.91 18.81,29.53 20.24,28.1 21.27,28.1 21.67,28.5 21.67,33.42 23.18,34.93 JP6.1 23.97,37.39 JP7.1

### Text on the board
tPlace: fb3.32_2x4_02
bNames: fb_contr_4.03